# Altium project Camera-MT.PrjPCB
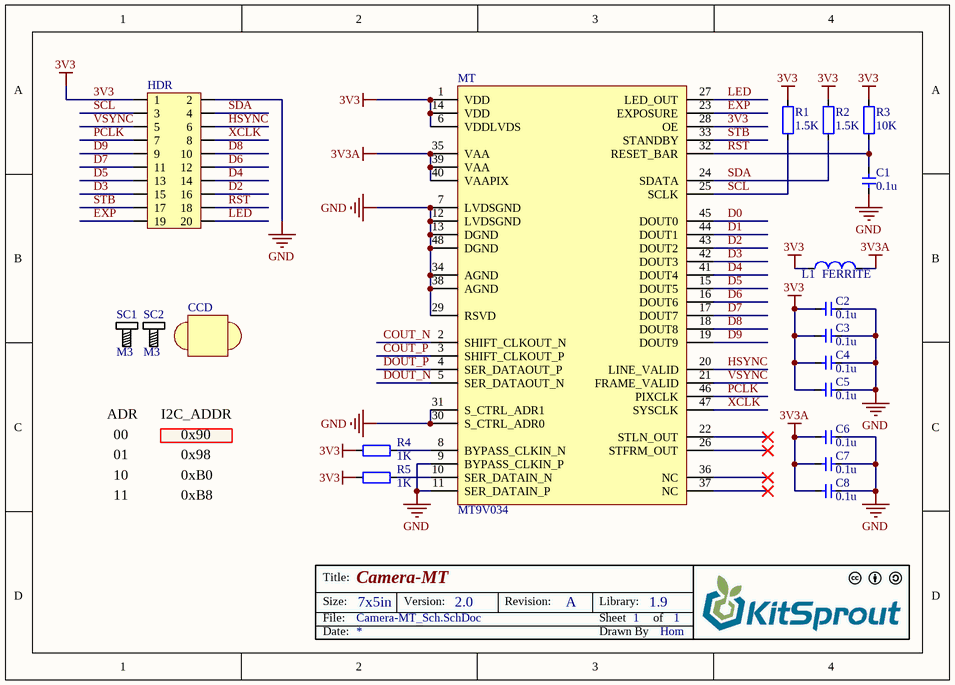
[diagram p0: Camera-MT_Sch.SchDoc]
1 sheet, 19 parts. Net scope: global (net labels, ports and power ports of the same name join across sheets).
Board file: Camera-MT_Pcb.PcbDoc

## Sheet Camera-MT_Sch.SchDoc: Camera-MT
size 177 x 127 mm; Author: Hom; CompanyName: KitSprout; DrawnBy: Hom; Engineer: Hom; Organization: KitSprout; Revision: A; SheetNumber: 1; SheetTotal: 1; Version: 2.0; LibVersion: 1.9; PageSetup: Record=PageOptions|CenterHorizontal=True|CenterVertical=True|PrintScale=1.00|XCorrection=1.00|YCorrection=1.00|PrintKind=0|BorderSize=5000000|LeftOffset=0|BottomOffset=0|Orientation=2|PaperLength=1000|PaperWidth=1000|Scale=100|PaperSource=7|PrintQuality=-3|MediaType=1|DitherType=10|PrintScaleMode=0|PaperKind=A4|PaperIndex=9

### Parts
C1  value 0.1u  [CAP_0603]  (hidden comment: Cap_0603)
C2  value 0.1u  [CAP_0603]  (hidden comment: Cap_0603)
C3  value 0.1u  [CAP_0402]  (hidden comment: Cap_0402)
C4  value 0.1u  [CAP_0603]  (hidden comment: Cap_0603)
C5  value 0.1u  [CAP_0603]  (hidden comment: Cap_0603)
C6  value 0.1u  [CAP_0603]  (hidden comment: Cap_0603)
C7  value 0.1u  [CAP_0603]  (hidden comment: Cap_0603)
C8  value 0.1u  [CAP_0603]  (hidden comment: Cap_0603)
CCD  CCD  [CCD_LENS_20MM]  (value not drawn)
HDR  HDR2x10_2.54  [HDR2X10_2.54_180]  (value not drawn)
L1  value FERRITE  [IND_0603]  (hidden comment: Ind_0603)
MT  MT9V034  [CLCC_48]
R1  value 1.5K  [RES_0603]  (hidden comment: Res_0603)
R2  value 1.5K  [RES_0603]  (hidden comment: Res_0603)
R3  value 10K  [RES_0603]  (hidden comment: Res_0603)
R4  value 1K  [RES_0603]  (hidden comment: Res_0603)
R5  value 1K  [RES_0603]  (hidden comment: Res_0603)
SC1  M3  [SCRREW_M3]
SC2  M3  [SCRREW_M3]

### Nets
3V3: C2.2 C3.2 C4.2 C5.2 HDR.1 L1.1 MT.1(VDD) MT.6(VDDLVDS) MT.14(VDD) MT.28(OE) R1.2 R2.2 R3.2 R4.2 R5.2
3V3A: C6.2 C7.2 C8.2 L1.2 MT.35(VAA) MT.39(VAA) MT.40(VAAPIX)
GND: C1.1 C2.1 C3.1 C4.1 C5.1 C6.1 C7.1 C8.1 HDR.2 MT.7(LVDSGND) MT.9(BYPASS_CLKIN_P) MT.11(SER_DATAIN_P) MT.12(LVDSGND) MT.13(DGND) MT.29(RSVD) MT.30(S_CTRL_ADR0) MT.31(S_CTRL_ADR1) MT.34(AGND) MT.38(AGND) MT.48(DGND)
COUT_N: MT.2(SHIFT_CLKOUT_N)
COUT_P: MT.3(SHIFT_CLKOUT_P)
D0: MT.45(DOUT0)
D1: MT.44(DOUT1)
D2: HDR.16 MT.43(DOUT2)
D3: HDR.15 MT.42(DOUT3)
D4: HDR.14 MT.41(DOUT4)
D5: HDR.13 MT.15(DOUT5)
D6: HDR.12 MT.16(DOUT6)
D7: HDR.11 MT.17(DOUT7)
D8: HDR.10 MT.18(DOUT8)
D9: HDR.9 MT.19(DOUT9)
DOUT_N: MT.5(SER_DATAOUT_N)
DOUT_P: MT.4(SER_DATAOUT_P)
EXP: HDR.19 MT.23(EXPOSURE)
HSYNC: HDR.6 MT.20(LINE_VALID)
LED: HDR.20 MT.27(LED_OUT)
PCLK: HDR.7 MT.46(PIXCLK)
RST: C1.2 HDR.18 MT.32(RESET_BAR) R3.1
SCL: HDR.3 MT.25(SCLK) R1.1
SDA: HDR.4 MT.24(SDATA) R2.1
STB: HDR.17 MT.33(STANDBY)
VSYNC: HDR.5 MT.21(FRAME_VALID)
XCLK: HDR.8 MT.47(SYSCLK)
NetMT_8: MT.8(BYPASS_CLKIN_N) R4.1
NetMT_10: MT.10(SER_DATAIN_N) R5.1

Not connected (* = marked no-connect by the designer): MT 22(STLN_OUT)* 26(STFRM_OUT)* 36(NC)* 37(NC)*

### Notes on the sheet
- ADR
- 00
- I2C_ADDR
- 0x90
- 01
- 10
- 11
- 0x98
- 0xB0
- 0xB8
- Title:
- Size:
- Date:
- File:
- 7x5in
- Version:
- Revision:
- Sheet
- Drawn By
- Library:
- of

### Library data of the parts
C1 C2 C4-C8 = Cap_0603: Capacitor
C3 = Cap_0402: Capacitor
CCD = lensCCD_20
HDR = HDR2x10_2.54: Header
L1 = Ind_0603: Inductor
MT = MT9V034: CMOS
R1-R5 = Res_0603: Resistor
SC1 SC2 = Screw_M3: Screw